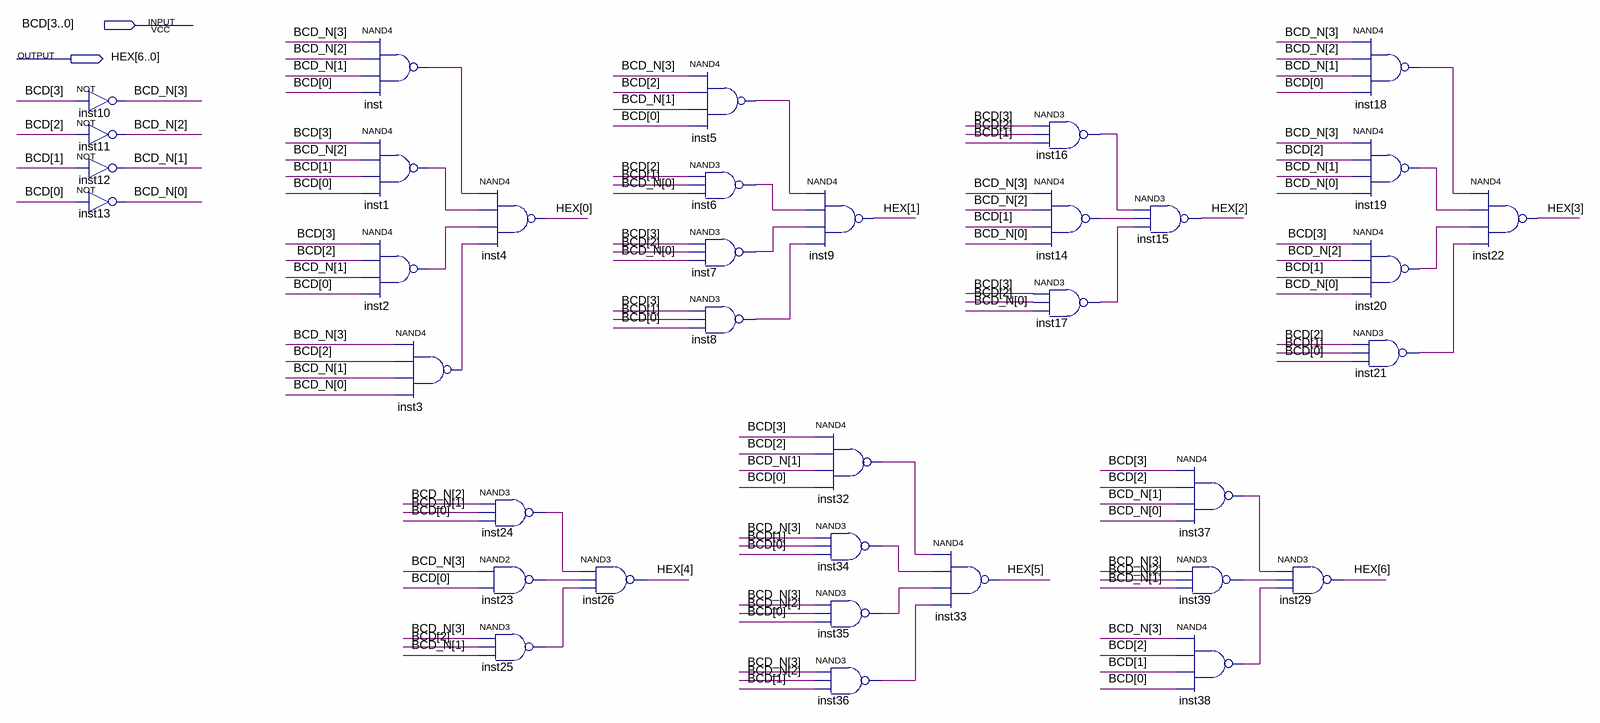
[diagram p0: schematic sheet]
// Quartus schematic BCD_7SEG_DECODER.bdf as structural Verilog: 36 symbols, 2 pins
module BCD_7SEG_DECODER (
  input  [3:0] BCD,
  output [6:0] HEX
);

  wire inst1_out, inst2_out, inst3_out, inst5_out, inst6_out, inst7_out, inst8_out, inst14_out, inst16_out,
       inst17_out, inst18_out, inst19_out, inst20_out, inst21_out, inst23_out, inst24_out, inst25_out,
       inst32_out, inst34_out, inst35_out, inst36_out, inst37_out, inst38_out, inst39_out, inst_out;
  wire [3:0] BCD_N;

  not inst10 (BCD_N[3], BCD[3]);
  not inst11 (BCD_N[2], BCD[2]);
  not inst12 (BCD_N[1], BCD[1]);
  not inst13 (BCD_N[0], BCD[0]);
  nand inst (inst_out, BCD_N[3], BCD_N[2], BCD_N[1], BCD[0]);
  nand inst1 (inst1_out, BCD[3], BCD_N[2], BCD[1], BCD[0]);
  nand inst2 (inst2_out, BCD[3], BCD[2], BCD_N[1], BCD[0]);
  nand inst3 (inst3_out, BCD_N[3], BCD[2], BCD_N[1], BCD_N[0]);
  nand inst4 (HEX[0], inst_out, inst1_out, inst2_out, inst3_out);
  nand inst24 (inst24_out, BCD_N[2], BCD_N[1], BCD[0]);
  nand inst23 (inst23_out, BCD_N[3], BCD[0]);
  nand inst25 (inst25_out, BCD_N[3], BCD[2], BCD_N[1]);
  nand inst26 (HEX[4], inst24_out, inst23_out, inst25_out);
  nand inst5 (inst5_out, BCD_N[3], BCD[2], BCD_N[1], BCD[0]);
  nand inst6 (inst6_out, BCD[2], BCD[1], BCD_N[0]);
  nand inst7 (inst7_out, BCD[3], BCD[2], BCD_N[0]);
  nand inst8 (inst8_out, BCD[3], BCD[1], BCD[0]);
  nand inst9 (HEX[1], inst5_out, inst6_out, inst7_out, inst8_out);
  nand inst32 (inst32_out, BCD[3], BCD[2], BCD_N[1], BCD[0]);
  nand inst34 (inst34_out, BCD_N[3], BCD[1], BCD[0]);
  nand inst35 (inst35_out, BCD_N[3], BCD_N[2], BCD[0]);
  nand inst36 (inst36_out, BCD_N[3], BCD_N[2], BCD[1]);
  nand inst33 (HEX[5], inst32_out, inst34_out, inst35_out, inst36_out);
  nand inst16 (inst16_out, BCD[3], BCD[2], BCD[1]);
  nand inst14 (inst14_out, BCD_N[3], BCD_N[2], BCD[1], BCD_N[0]);
  nand inst17 (inst17_out, BCD[3], BCD[2], BCD_N[0]);
  nand inst15 (HEX[2], inst16_out, inst14_out, inst17_out);
  nand inst37 (inst37_out, BCD[3], BCD[2], BCD_N[1], BCD_N[0]);
  nand inst39 (inst39_out, BCD_N[3], BCD_N[2], BCD_N[1]);
  nand inst38 (inst38_out, BCD_N[3], BCD[2], BCD[1], BCD[0]);
  nand inst29 (HEX[6], inst37_out, inst39_out, inst38_out);
  nand inst18 (inst18_out, BCD_N[3], BCD_N[2], BCD_N[1], BCD[0]);
  nand inst19 (inst19_out, BCD_N[3], BCD[2], BCD_N[1], BCD_N[0]);
  nand inst20 (inst20_out, BCD[3], BCD_N[2], BCD[1], BCD_N[0]);
  nand inst21 (inst21_out, BCD[2], BCD[1], BCD[0]);
  nand inst22 (HEX[3], inst18_out, inst19_out, inst20_out, inst21_out);
endmodule
